# EAGLE design DURST_VT4_V0.3 (EAGLE 9.6.2)
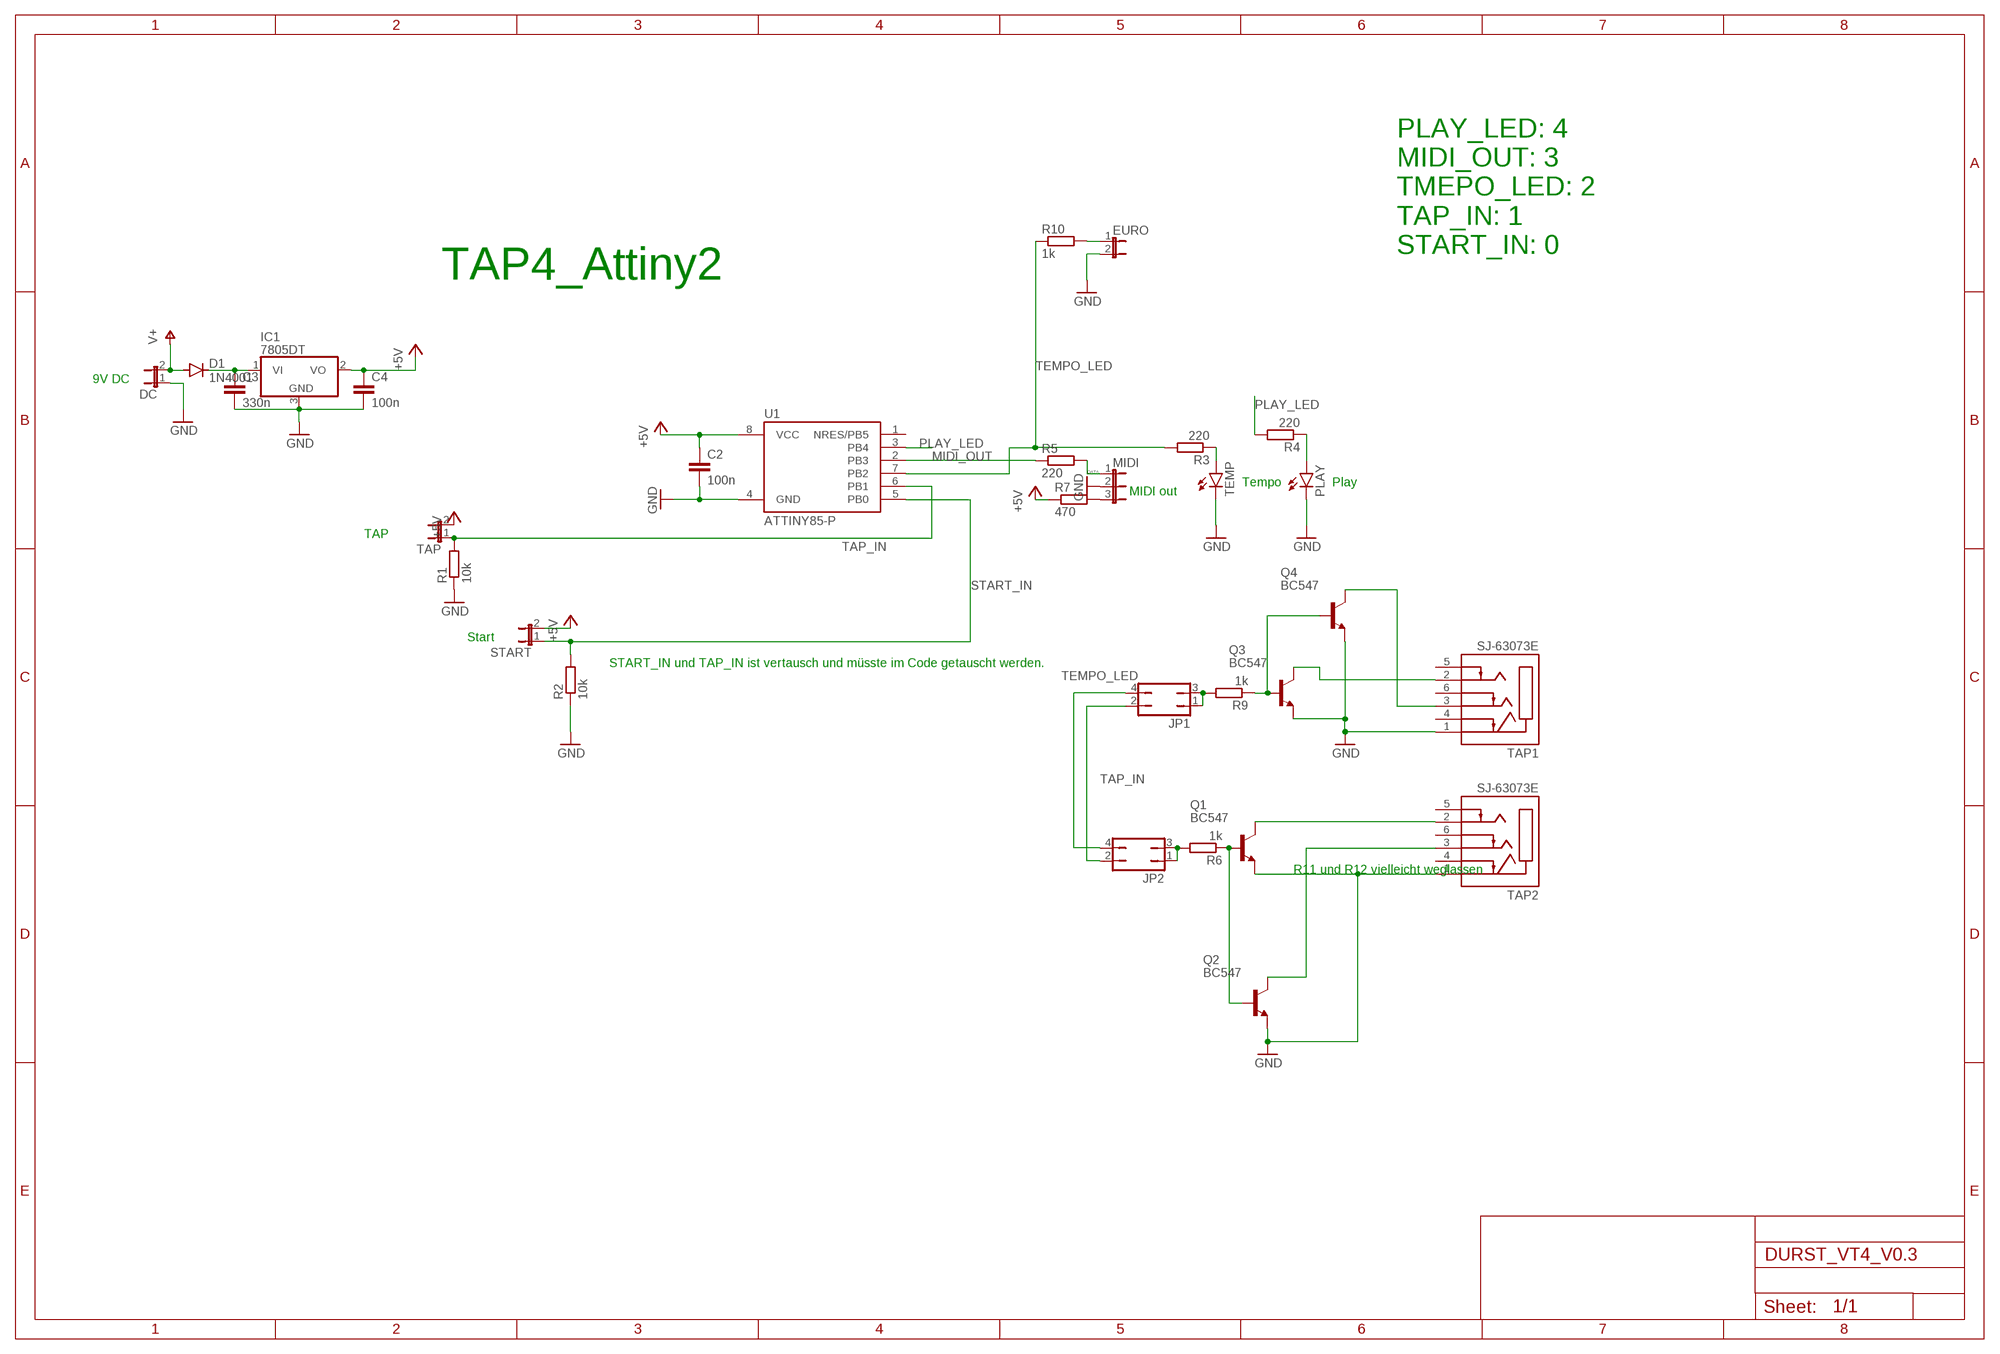
[diagram p0: schematic, sheet 1]

## Parts
C2  100n  C-EU050-024X044  [C050-024X044]
C3  330n  C-EU025-024X044  [C025-024X044]
C4  100n  C-EU025-024X044  [C025-024X044]
D1  1N4001  1N4004  [DO41-10]
DC  JP1E  [JP1]
EURO  JP1E  [JP1]
IC1  7805DT  [TO252]
JP1  JP2Q  [JP2Q]
JP2  JP2Q  [JP2Q]
MIDI  JP2E  [JP2]
PLAY  LED5MM  [LED5MM]
Q1  BC547  [TO92]
Q2  BC547  [TO92]
Q3  BC547  [TO92]
Q4  BC547  [TO92]
R1  10k  R-EU_0309/10  [0309/10]
R2  10k  R-EU_0309/10  [0309/10]
R3  220  R-EU_0309/10  [0309/10]
R4  220  R-EU_0309/10  [0309/10]
R5  220  R-EU_0309/10  [0309/10]
R6  1k  R-EU_0309/10  [0309/10]
R7  470  R-EU_0309/10  [0309/10]
R9  1k  R-EU_0309/10  [0309/10]
R10  1k  R-EU_0309/10  [0309/10]
START  JP1E  [JP1]
TAP  JP1E  [JP1]
TAP1  SJ-63073E  [CUI_SJ-63073E]
TAP2  SJ-63073E  [CUI_SJ-63073E]
TEMP  LED5MM  [LED5MM]
U1  ATTINY85-P  [PDIP08_300MIL]

## Nets
+5V [power]: C2.1 C4.1 IC1.2(VO) R7.1 START.2 TAP.2 U1.8(VCC)
DATA: MIDI.1 R5.2
GND [power]: C2.2 C3.2 C4.2 DC.1 EURO.2 IC1.3(GND) MIDI.2 PLAY.K(C) Q1.1(E) Q2.1(E) Q3.1(E) Q4.1(E) R1.1 R2.1 TAP1.1(SLEEVE) TAP2.1(SLEEVE) TEMP.K(C) U1.4(GND)
MIDI_OUT: R5.1 U1.2(PB3)
N$1: EURO.1 R10.2
N$2: Q4.3(C) TAP1.3(RING)
N$3: Q2.3(C) TAP2.3(RING)
N$5: R3.1 TEMP.A
N$6: PLAY.A R4.1
N$7: JP1.1 JP1.3 R9.2
N$9 [power]: C3.1 D1.C IC1.1(VI)
N$10: JP2.1 JP2.3 R6.2
N$11: MIDI.3 R7.2
N$14: Q3.3(C) TAP1.2(TIP)
N$16: Q1.3(C) TAP2.2(TIP)
N$21: Q1.2(B) Q2.2(B) R6.1
N$22: Q3.2(B) Q4.2(B) R9.1
PLAY_LED: R4.2 U1.3(PB4)
START_IN: R2.2 START.1 U1.5(PB0)
TAP_IN: JP1.2 JP2.2 R1.2 TAP.1 U1.6(PB1)
TEMPO_LED: JP1.4 JP2.4 R3.2 R10.1 U1.7(PB2)
V+ [power]: D1.A DC.2
Unconnected: TAP1.4(SLEEVE_SWITCH) TAP1.5(TIP_SWITCH) TAP1.6(RING_SWITCH) TAP2.4(SLEEVE_SWITCH) TAP2.5(TIP_SWITCH) TAP2.6(RING_SWITCH) U1.1(NRES/PB5)

## Notes on the sheet
- PLAY_LED: 4
  MIDI_OUT: 3
  TMEPO_LED: 2
  TAP_IN: 1
  START_IN: 0
- TAP4_Attiny2
- 9V DC
- MIDI out | Tempo | Play
- TAP
- Start
- START_IN und TAP_IN ist vertausch und müsste im Code getauscht werden.
- R11 und R12 vielleicht weglassen

## Library data of the parts
C2-C4 = rcl:C-EU: CAPACITOR, European symbol; SPICEPREFIX: C
D1 = diode:1N4004: DIODE general purpose rectifier, 1 A
DC EURO START TAP = jumper:JP1E: JUMPER
IC1 = linear:78*: Positive VOLTAGE REGULATOR Source: http://cache.national.com/ds/LM/LM78L05.pdf http://www.fairchildsemi.com/ds/LM/LM7805.pdf
JP1 JP2 = jumper:JP2Q: JUMPER
MIDI = jumper:JP2E: JUMPER
PLAY TEMP = led:LED: LED OSRAM: - CHIPLED LG R971, LG N971, LY N971, LG Q971, LY Q971, LO R971, LY R971 LH N974, LH R974 LS Q976, LO Q976, LY Q976 LO Q996 - Hyper CHIPLED LW Q18S LB Q993, LB Q99A, LB R99A - SideLED LS A670, LO A670, LY A670, LG A670, LP A670 LB A673, LV A673, LT A673, LW A673 LH A674 LY A675 LS A676, LA A676, LO A676, LY A676, LW A676 LS A679, LY A679, LG A679 - Hyper Micro SIDELED® LS Y876, LA Y876, LO Y876, LY Y876 LT Y87S - SmartLED LW L88C, LW L88S LB L89C, LB L89S, LG L890 LS L89K, LO L89K, LY L89K LS L896, LA L896, LO L896, LY L896 - TOPLED LS T670, LO T670, LY T670, LG T670, LP T670 LSG T670, LSP T670, LSY T670, LOP T670, LYG T670 LG T671, LOG T671, LSG T671 LB T673, LV T673, LT T673, LW T673 LH T674 LS T676, LA T676, LO T676, LY T676, LB T676, LH T676, LSB T676, LW T676 LB T67C, LV T67C, LT T67C, LS T67K, LO T67K, LY T67K, LW E67C LS E67B, LA E67B, LO E67B, LY E67B, LB E67C, LV E67C, LT E67C LW T67C LS T679, LY T679, LG T679 LS T770, LO T770, LY T770, LG T770, LP T770 LB T773, LV T773, LT T773, LW T773 LH T774 LS E675, LA E675, LY E675, LS T675 LS T776, LA T776, LO T776, LY T776, LB T776 LHGB T686 LT T68C, LB T68C - Hyper Mini TOPLED® LB M676 - Mini TOPLED Santana® LG M470 LS M47K, LO M47K, LY M47K Source: http://www.osram.convergy.de LUXEON: - LUMILED® LXK2-PW12-R00, LXK2-PW12-S00, LXK2-PW14-U00, LXK2-PW14-V00 LXK2-PM12-R00, LXK2-PM12-S00, LXK2-PM14-U00 LXK2-PE12-Q00, LXK2-PE12-R00, LXK2-PE12-S00, LXK2-PE14-T00, LXK2-PE14-U00 LXK2-PB12-K00, LXK2-PB12-L00, LXK2-PB12-M00, LXK2-PB14-N00, LXK2-PB14-P00, LXK2-PB14-Q00 LXK2-PR12-L00, LXK2-PR12-M00, LXK2-PR14-Q00, LXK2-PR14-R00 LXK2-PD12-Q00, LXK2-PD12-R00, LXK2-PD12-S00 LXK2-PH12-R00, LXK2-PH12-S00 LXK2-PL12-P00, LXK2-PL12-Q00, LXK2-PL12-R00 Source: www.luxeon.com KINGBRIGHT: KA-3528ASYC Source: www.kingbright.com
Q1-Q4 = transistor-neu-to92:BC547: NPN TRANSISTOR
R1-R7 R9 R10 = rcl:R-EU_: RESISTOR, European symbol; SPICEPREFIX: R
TAP1 TAP2 = SJ-63073E:SJ-63073E: Check availability <https://pricing.snapeda.com/parts/SJ-63073E/CUI%20Devices/view-part?ref=eda>; AVAILABILITY: In Stock; CUI_PURCHASE_URL: https://www.cuidevices.com/product/interconnect/connectors/audio-connectors/jacks/sj-6307-series?utm_source=snapeda.com&utm_medium=referral&utm_campaign=snapedaBOM; DESCRIPTION: 6.35 mm, Mono and Stereo, Right Angle, Through Hole, 2~3 Conductors, 2~3 Internal Switches, Audio Jack Connector; MF: CUI Devices; MP: SJ-63073E; PACKAGE: None; PRICE: None; PURCHASE-URL: https://pricing.snapeda.com/search/part/SJ-63073E/?ref=eda
U1 = Attiny25_45_85:ATTINY85*: ATMEL ATtiny 85 Packages: P = PDIP 08 30mil S = SOIC 08 EIAJ 208mil Technologies Note: for complete ordering code (temp. range, finish, tape&reel etc.) see www.atmel.com • Supply Voltage: V = (1.8…5.5)V | [blank] = (2.7…5.5)V • Speed: 10 = 10 MHz | 20 = 20 MHz Author: Dipl.-Ing. FH Rainer Bayer HHN Hochschule Heilbronn (Heilbronn University), rainer.bayer@hs-heilbronn.de Ingenieurbüro ing-rb, mail@ing-rb.de

## Net classes
0 default: width 0.305 mm, drill 0.305 mm
1 power: width 0.635 mm

## Board
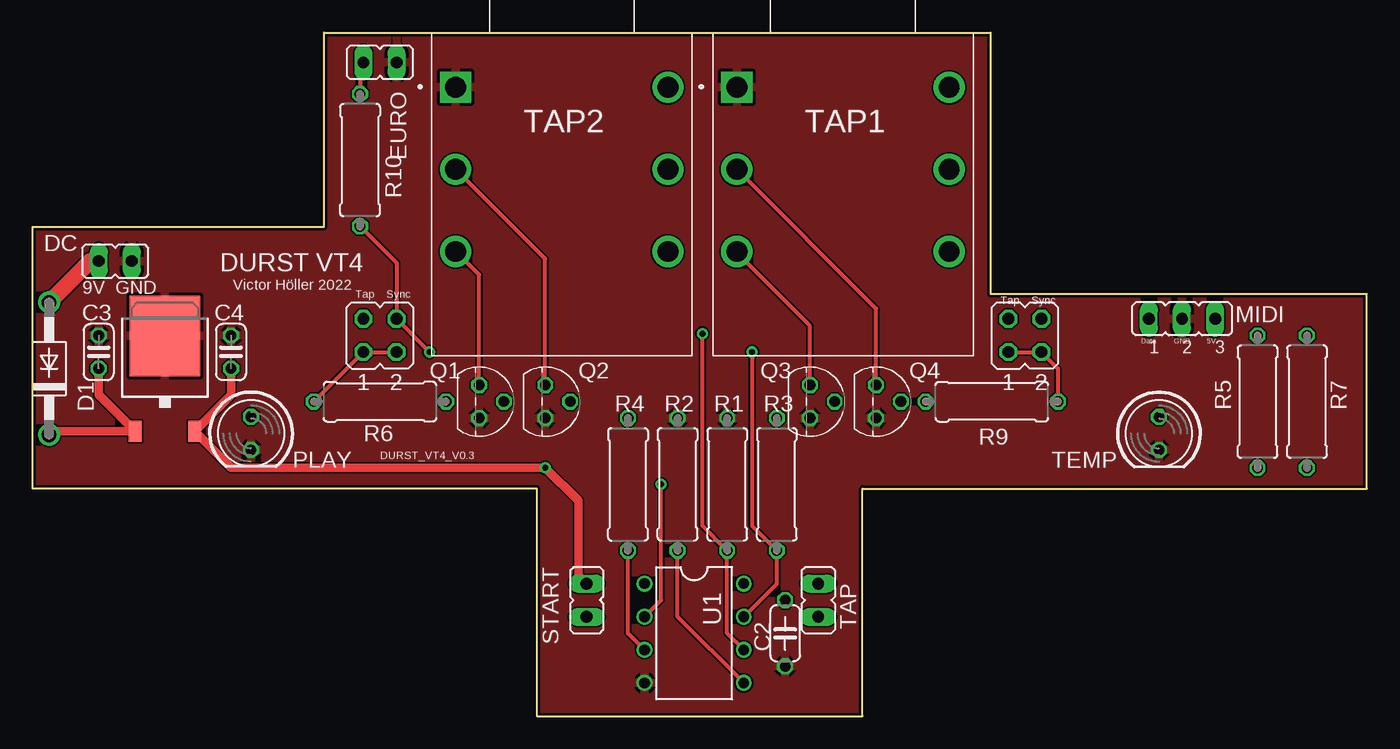
[diagram p1: board, top side]
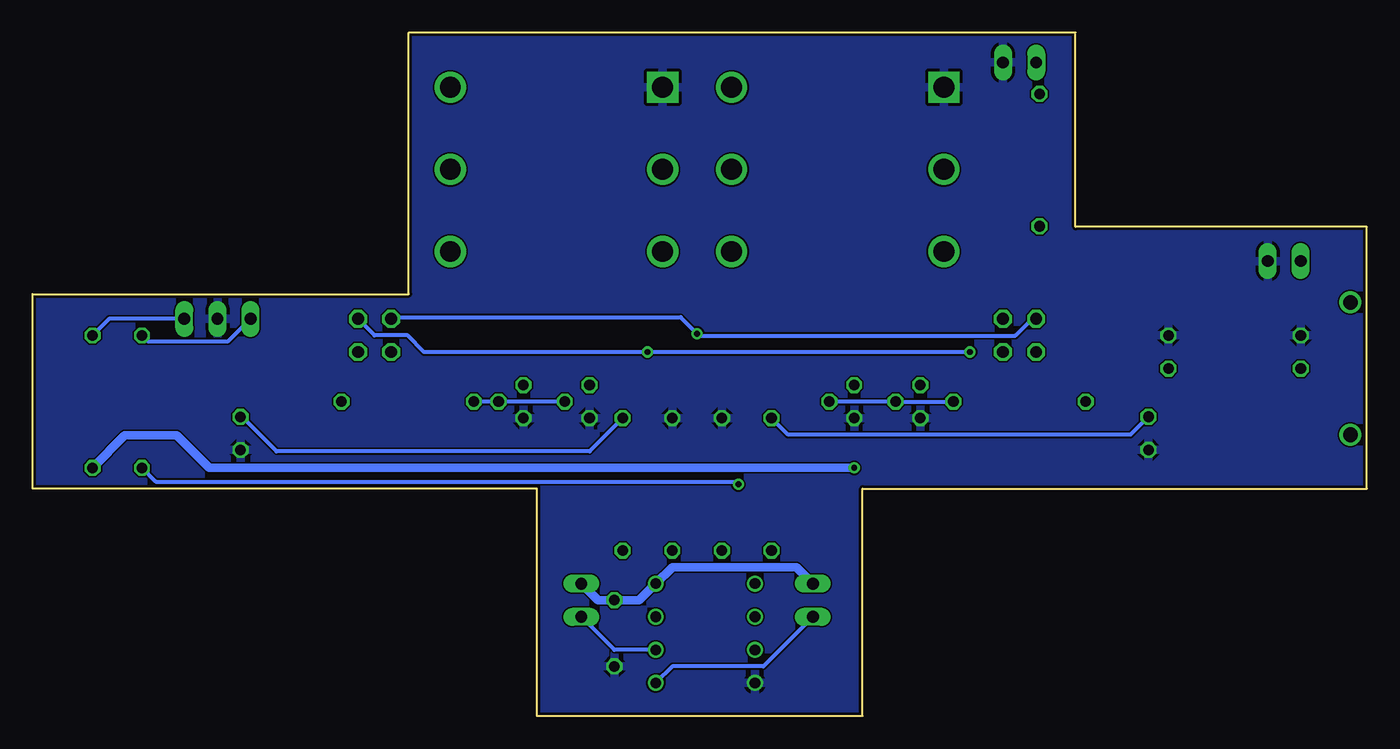
[diagram p2: board, bottom side, seen from below]

Size 102.46 x 52.46 mm. Coordinates in mm from the lower left corner, seen from the top.
Outline: 38.73,0 63.73,0 63.73,17.46 102.46,17.46 102.46,32.38 73.57,32.38 73.57,52.46 22.38,52.46 22.38,37.54 0,37.54 0,17.46 38.73,17.46 38.73,0
Copper layers (1*16): Top 0.035mm / dielectric 1.5mm / Bottom 0.035mm
Design rules "jlcpcb": minimum track width 5mil, minimum drill 0.3mm, track to track 5mil, track to pad 5mil, pad to pad 5mil, via to via 5mil, smd to smd 5mil, copper to edge 0.2mm, drill to drill 6mil, minimum pad ring 3mil, minimum via ring 8mil, stop-mask expansion 0mil, vias tented up to drill 15mil, thermal gap 10mil

### Footprints (pad centres in the part's own frame; a part is rotated, then mirrored left to right if it is on the bottom)
C050-024X044 = drill 0.813 octagon: 1 -2.54,0; 2 2.54,0
C025-024X044 = drill 0.813 octagon: 1 -1.27,0; 2 1.27,0
DO41-10 = drill 1.118: A 5.08,0; C -5.08,0
JP1 = drill 0.914 long: 1 0,-1.27; 2 0,1.27
TO252 = smd 1 x 1.6: 1 -2.28,-4.8; 2 2.28,-4.8 | smd 5.4 x 6.2: 3 0,2.5
JP2Q = drill 0.914 octagon: 1 -1.27,-1.27; 2 -1.27,1.27; 3 1.27,-1.27; 4 1.27,1.27
JP2 = drill 0.914 long: 1 -2.54,0; 2 0,0; 3 2.54,0
LED5MM = drill 0.813 octagon: A -1.27,0; K 1.27,0
TO92 = drill 0.813 octagon: 1 1.27,0; 2 0,1.905; 3 -1.27,0
0309/10 = drill 0.813 octagon: 1 -5.08,0; 2 5.08,0
CUI_SJ-63073E = drill 1.6 square: 1 0,-8.15 | drill 1.6: 2 12.6,-8.15; 3 6.3,-8.15; 4 0,8.15; 5 12.6,8.15; 6 6.3,8.15
PDIP08_300MIL = drill 0.813: 1 -3.81,-3.81; 2 -1.27,-3.81; 3 1.27,-3.81; 4 3.81,-3.81; 5 3.81,3.81; 6 1.27,3.81; 7 -1.27,3.81; 8 -3.81,3.81

### Placement (x,y rotation side)
C2  57.78,6.35 270 top
C3  5.08,27.94 90 top
C4  15.24,27.94 90 top
D1  1.27,26.67 90 top
DC  6.35,34.93 90 top
EURO  26.67,50.16 270 top
IC1  10.16,26.67 0 top
JP1  76.2,29.21 0 top
JP2  26.67,29.21 0 top
MIDI  88.27,30.48 0 top
PLAY  16.78,21.7 270 top
Q1  34.29,24.13 270 top
Q2  39.37,24.13 270 top
Q3  59.69,24.13 270 top
Q4  64.77,24.13 270 top
R1  53.34,17.78 270 top
R2  49.53,17.78 270 top
R3  57.15,17.78 270 top
R4  45.72,17.78 270 top
R5  94.06,24.13 90 top
R6  26.67,24.13 180 top
R7  97.86,24.13 90 top
R9  73.66,24.13 0 top
R10  25.15,42.67 90 top
START  42.54,8.89 0 top
TAP  60.32,8.89 0 top
TAP1  62.23,48.26 270 top
TAP2  40.64,48.26 270 top
TEMP  86.49,21.69 270 top
U1  50.8,6.35 270 top

### Tracks (layer width: path | path; a pad name or v marks a point on that pad's centre or on a via)
+5V  (via drill 0.45)
  Top 0.635: C4.1 15.24,24.67 IC1.2 15.26,19.05 v39.37,19.05 41.91,16.51 41.91,10.8 START.2
  Bottom 0.635: R7.1 95.37,21.53 91.38,21.53 88.9,19.05 v39.37,19.05 | START.2 43.81,11.43 53.34,11.43 U1.8 55.88,8.89 C2.1 59.05,8.89 TAP.2
DATA
  Bottom 0.305: R5.2 93.63,28.78 87.42,28.78 MIDI.1
GND
  pour Top: -1.27,55.88 105.41,55.88 105.41,12.7 105.41,-3.81 34.29,-3.81 -2.54,-3.81 -2.54,55.88
  pour Bottom: -2.54,54.61 104.14,54.61 104.14,-5.08 -2.54,-5.08
MIDI_OUT  (via drill 0.45)
  Top 0.305: U1.2 48.26,8.89 v48.26,17.78
  Bottom 0.305: v48.26,17.78 48.47,17.99 93,17.99 R5.1
N$1
  Top 0.305: EURO.1 25.15,49.91 R10.2
N$2
  Top 0.305: Q4.3 64.77,31.27 TAP1.3
N$3
  Top 0.305: TAP2.3 37.86,36.59 37.93,36.52 39.37,35.08 Q2.3
N$5
  Bottom 0.305: TEMP.A 86.36,22.96 83.72,20.32 59.69,20.32 R3.1
N$6
  Bottom 0.305: PLAY.A 18.16,21.59 44.45,21.59 R4.1
N$7
  Top 0.305: JP1.1 JP1.3 78.74,26.67 R9.2
N$9
  Top 0.635: D1.C 1.55,21.87 IC1.1 5.35,24.4 5.08,24.67 C3.1
N$10
  Top 0.305: R6.2 JP2.1 JP2.3
N$11
  Bottom 0.305: MIDI.3 96.59,30.48 R7.2
N$14
  Top 0.305: TAP1.2 54.08,35.56 59.69,29.95 Q3.3
N$16
  Top 0.305: Q1.3 34.29,33.86 TAP2.2
N$21
  Bottom 0.305: Q2.2 Q1.2 R6.1
N$22
  Bottom 0.305: Q3.2 Q4.2 R9.1
PLAY_LED
  Top 0.305: U1.3 45.72,6.35 R4.2
START_IN
  Top 0.305: U1.5 49.53,7.62 R2.2
  Bottom 0.305: START.1 46.35,3.81 53.34,3.81 U1.5
TAP_IN  (via drill 0.45)
  Top 0.305: U1.6 53.34,6.35 R1.2 51.43,14.61 v51.43,29.35
  Bottom 0.305: JP2.2 25.71,30.48 27,29.19 51.28,29.19 v51.43,29.35 52.7,30.62 74.79,30.62 | U1.6 57.78,5.08 TAP.1
  Bottom 0.635: JP1.2 74.79,30.62
TEMPO_LED  (via drill 0.45)
  Top 0.305: R10.1 27.94,34.8 JP2.4 v30.48,27.94 | U1.7 57.15,10.16 R3.2 55.24,14.61 v55.24,27.94
  Bottom 0.305: JP1.4 76.2,29.21 73.66,29.21 72.39,27.94 v55.24,27.94 v30.48,27.94
V+
  Top 1.27: DC.2 4.45,34.93 D1.A

### Text on the board
tNames: DURST VT4 | Victor Höller 2022 | 9V | GND | Tap | Sync | Tap | Sync | Data | GND | 5V | DURST_VT4_V0.3